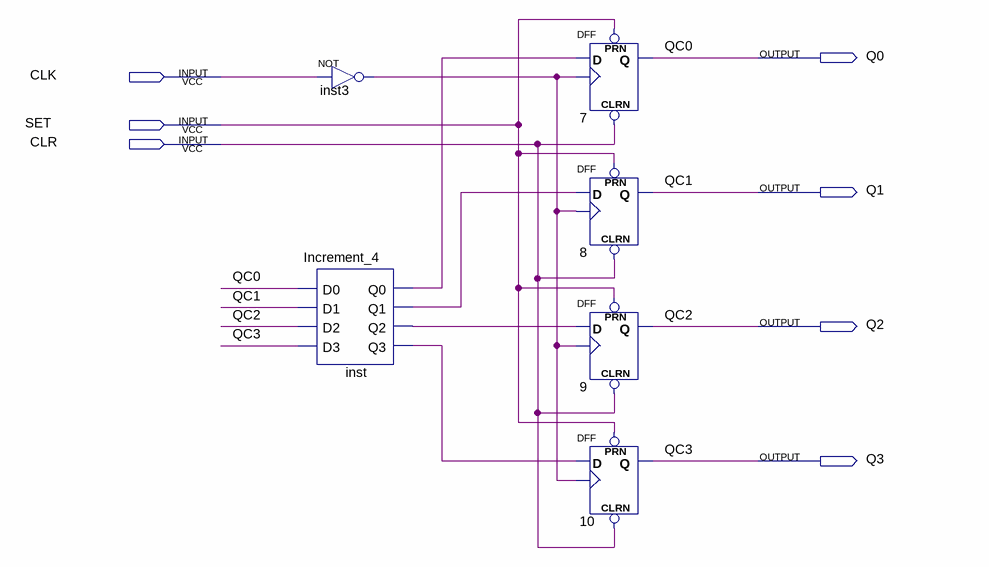
[diagram p0: schematic sheet]
// Quartus schematic counter_4scb.bdf as structural Verilog: 6 symbols, 7 pins
module counter_4scb (
  input  CLK,
  input  SET,
  input  CLR,
  output Q0,
  output Q1,
  output Q2,
  output Q3
);

  wire inst3_out, inst_q0, inst_q1, inst_q2, inst_q3;

  not inst3 (inst3_out, CLK);
  Increment_4 inst (.D0(Q0), .D1(Q1), .D2(Q2), .D3(Q3), .Q0(inst_q0), .Q1(inst_q1), .Q2(inst_q2), .Q3(inst_q3));
  DFF u_7 (.CLRN(CLR), .CLK(inst3_out), .D(inst_q0), .PRN(SET), .Q(Q0));
  DFF u_8 (.CLRN(CLR), .CLK(inst3_out), .D(inst_q1), .PRN(SET), .Q(Q1));
  DFF u_9 (.CLRN(CLR), .CLK(inst3_out), .D(inst_q2), .PRN(SET), .Q(Q2));
  DFF u_10 (.CLRN(CLR), .CLK(inst3_out), .D(inst_q3), .PRN(SET), .Q(Q3));

  // Other names for the same wires on the sheet: QC0 = Q0; QC1 = Q1; QC2 = Q2; QC3 = Q3
endmodule
